# Altium project -STM32-Ethernet-IO-Gateway.PrjPcb
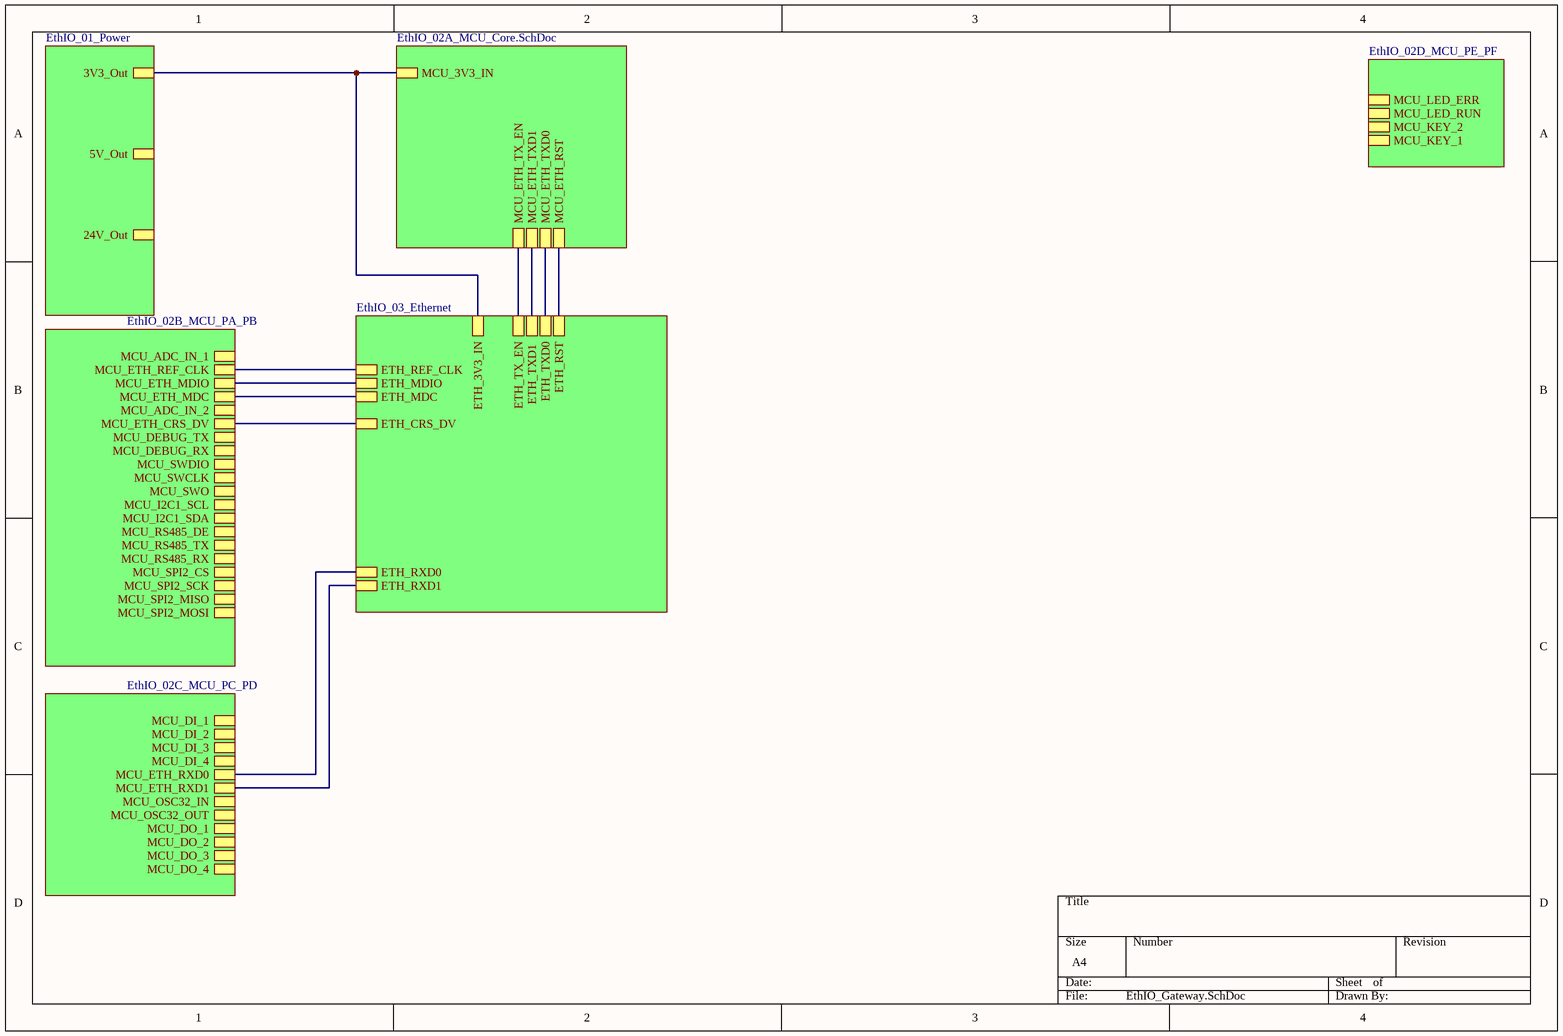
[diagram p0: EthIO_Gateway.SchDoc]
7 sheets, 89 parts. Net scope: hierarchical (ports join the sheet entries above them; power ports are global).
Board file: EthIO_Gateway.PcbDoc
Sheets:
  EthIO_Gateway.SchDoc
    EthIO_01_Power = EthIO_01_Power.SchDoc
    EthIO_02A_MCU_Core.SchDoc = EthIO_02A_MCU_Core.SchDoc
    EthIO_02B_MCU_PA_PB = EthIO_02B_MCU_PA_PB.SchDoc
    EthIO_02C_MCU_PC_PD = EthIO_02C_MCU_PC_PD.SchDoc
    EthIO_02D_MCU_PE_PF = EthIO_02D_MCU_PE_PF.SchDoc
    EthIO_03_Ethernet = EthIO_03_Ethernet.SchDoc

## Sheet EthIO_Gateway.SchDoc
size A4; SheetNumber: 1; SheetTotal: 7

### Sub-sheets
EthIO_01_Power = EthIO_01_Power: 3V3_Out, 5V_Out, 24V_Out
EthIO_02A_MCU_Core.SchDoc = EthIO_02A_MCU_Core.SchDoc: MCU_3V3_IN, MCU_ETH_TX_EN, MCU_ETH_TXD0, MCU_ETH_TXD1, MCU_ETH_RST
EthIO_02B_MCU_PA_PB = EthIO_02B_MCU_PA_PB: MCU_ADC_IN_1, MCU_ETH_REF_CLK, MCU_ETH_MDIO, MCU_ETH_MDC, MCU_ADC_IN_2, MCU_ETH_CRS_DV, MCU_DEBUG_TX, MCU_DEBUG_RX, MCU_SWDIO, MCU_SWCLK, MCU_SWO, MCU_I2C1_SCL, MCU_I2C1_SDA, MCU_RS485_DE, MCU_RS485_TX, MCU_RS485_RX, MCU_SPI2_CS, MCU_SPI2_SCK, MCU_SPI2_MISO, MCU_SPI2_MOSI
EthIO_02C_MCU_PC_PD = EthIO_02C_MCU_PC_PD: MCU_DI_1, MCU_DI_2, MCU_DI_3, MCU_DI_4, MCU_ETH_RXD0, MCU_ETH_RXD1, MCU_OSC32_IN, MCU_OSC32_OUT, MCU_DO_1, MCU_DO_2, MCU_DO_3, MCU_DO_4
EthIO_02D_MCU_PE_PF = EthIO_02D_MCU_PE_PF: MCU_KEY_1, MCU_KEY_2, MCU_LED_RUN, MCU_LED_ERR
EthIO_03_Ethernet = EthIO_03_Ethernet: ETH_TXD0, ETH_TXD1 , ETH_TX_EN, ETH_REF_CLK, ETH_MDC, ETH_CRS_DV, ETH_RXD1, ETH_MDIO, ETH_RXD0, ETH_RST, ETH_3V3_IN

### Nets
3V3_Out: sheet EthIO_01_Power/3V3_Out, sheet EthIO_02A_MCU_Core.SchDoc/MCU_3V3_IN, sheet EthIO_03_Ethernet/ETH_3V3_IN
ETH_CRS_DV: sheet EthIO_02B_MCU_PA_PB/MCU_ETH_CRS_DV, sheet EthIO_03_Ethernet/ETH_CRS_DV
ETH_MDC: sheet EthIO_02B_MCU_PA_PB/MCU_ETH_MDC, sheet EthIO_03_Ethernet/ETH_MDC
ETH_MDIO: sheet EthIO_02B_MCU_PA_PB/MCU_ETH_MDIO, sheet EthIO_03_Ethernet/ETH_MDIO
ETH_REF_CLK: sheet EthIO_02B_MCU_PA_PB/MCU_ETH_REF_CLK, sheet EthIO_03_Ethernet/ETH_REF_CLK
ETH_RST: sheet EthIO_02A_MCU_Core.SchDoc/MCU_ETH_RST, sheet EthIO_03_Ethernet/ETH_RST
ETH_RXD0: sheet EthIO_02C_MCU_PC_PD/MCU_ETH_RXD0, sheet EthIO_03_Ethernet/ETH_RXD0
ETH_RXD1: sheet EthIO_02C_MCU_PC_PD/MCU_ETH_RXD1, sheet EthIO_03_Ethernet/ETH_RXD1
ETH_TX_EN: sheet EthIO_02A_MCU_Core.SchDoc/MCU_ETH_TX_EN, sheet EthIO_03_Ethernet/ETH_TX_EN
ETH_TXD0: sheet EthIO_02A_MCU_Core.SchDoc/MCU_ETH_TXD0, sheet EthIO_03_Ethernet/ETH_TXD0
ETH_TXD1: sheet EthIO_02A_MCU_Core.SchDoc/MCU_ETH_TXD1, sheet EthIO_03_Ethernet/ETH_TXD1 

## Sheet EthIO_01_Power.SchDoc
size A4; SheetNumber: 2; SheetTotal: 5
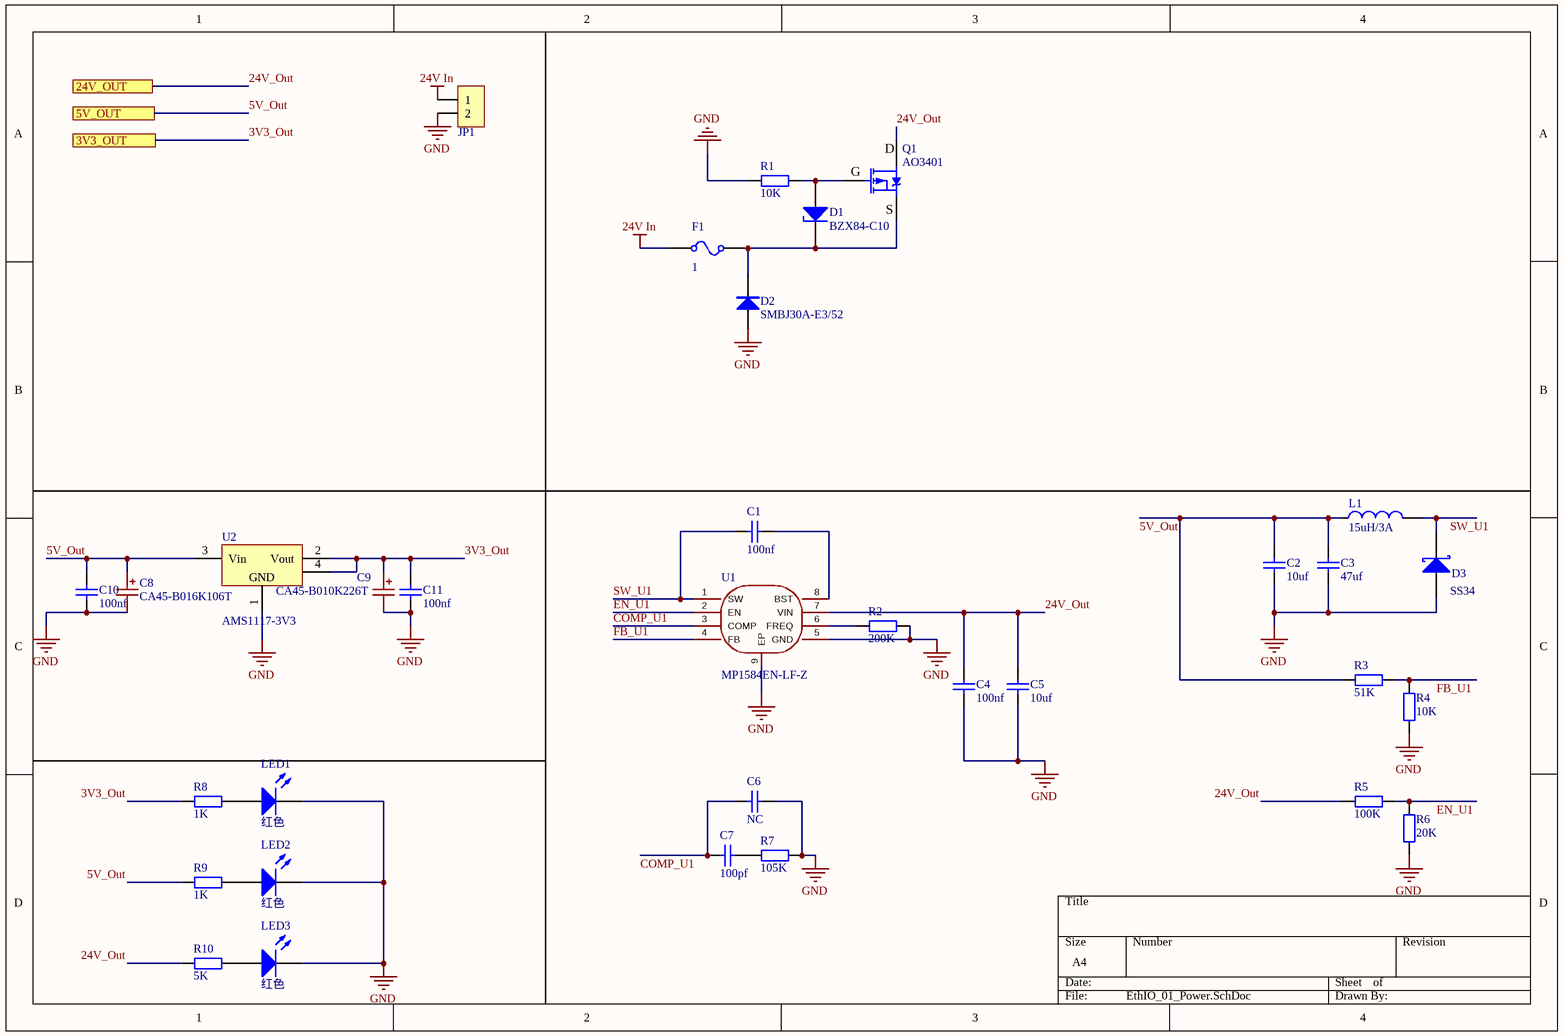
[diagram p1: EthIO_01_Power.SchDoc]

### Parts
C1  100nf  [C0805_L]
C2  10uf  [C0805_L]
C3  47uf  [C0805_L]
C4  100nf  [C0805_L]
C5  10uf  [C0805_L]
C6  NC  [C0805_L]
C7  100pf  [C0805_L]
C8  CA45-B016K106T  [CA45-B016K106T]
C9  CA45-B010K226T  [CA45-B016K106T]
C10  100nf  [C0805_L]
C11  100nf  [C0805_L]
D1  BZX84-C10  [SOD-123]
D2  SMBJ30A-E3/52  [SMB]
D3  SS34  [SMA]
F1  CURRENT: 1  (hidden comment: Fuse)
JP1  HDR-1X2  [KF128-3.81-2P]  (value not drawn)
L1  15uH/3A  [L0805]
LED1  红色  [LED0805_G]
LED2  红色  [LED0805_G]
LED3  红色  [LED0805_G]
Q1  AO3401  [SOT23-3N]
R1  10K  [R0805_L]
R2  200K  [R0805_L]
R3  51K  [R0805_L]
R4  10K  [R0805_L]
R5  100K  [R0805_L]
R6  20K  [R0805_L]
R7  105K  [R0805_L]
R8  1K  [R0805_L]
R9  1K  [R0805_L]
R10  5K  [R0805_L]
U1  MP1584EN-LF-Z  [MP1584EN-LF-Z]
U2  AMS1117-3V3  [SOT223_L]

### Ports
3V3_OUT (see EthIO_Gateway[1A]), 5V_OUT (see EthIO_Gateway[1A]), 24V_OUT (see EthIO_Gateway[1A])

### Nets
24V In: F1.2 JP1.1
GND: C2.1 C3.1 C4.1 C5.1 C6.1 C8.2 C9.2 C10.1 C11.1 D2.1(A) D3.1(A) JP1.2 LED1.2(K) LED2.2(K) LED3.2(K) R1.1 R2.2 R4.1 R6.2 R7.1 U1.5(GND) U1.9(EP) U2.1(GND)
3V3_Out: C9.1 C11.2 R8.1 U2.2(Vout) U2.4(GND) ; port 3V3_OUT
5V_Out: C2.2 C3.2 C8.1 C10.2 L1.1 R3.1 R9.1 U2.3(Vin) ; port 5V_OUT
24V_Out: C4.2 C5.2 Q1.3(D) R5.1 R10.1 U1.7(VIN) ; port 24V_OUT
COMP_U1: C6.2 C7.2 U1.3(COMP)
EN_U1: R5.2 R6.1 U1.2(EN)
FB_U1: R3.2 R4.2 U1.4(FB)
SW_U1: C1.2 D3.2(K) L1.2 U1.1(SW)
NetC1_1: C1.1 U1.8(BST)
NetC7_1: C7.1 R7.2
NetD1_1: D1.1(A) Q1.1(G) R1.2
NetD1_2: D1.2(K) D2.2(K) F1.1 Q1.2(S)
NetLED1_1: LED1.1(A) R8.2
NetLED2_1: LED2.1(A) R9.2
NetLED3_1: LED3.1(A) R10.2
NetR2_1: R2.1 U1.6(FREQ)

### Library data of the parts
C1-C7 C10 C11 = C: 贴片电容/MLCC电容; BOM名称: 无极性贴片电容; 当前库版本V2022.12.25 @淘宝卖家:黄晶宝石: 最新版本发布https://shop463601444.taobao.com
C9 = CA45-B016K106T
D1 = 稳压二极管: Zener Diode; 当前库版本V2022.12.25 @淘宝卖家:黄晶宝石: 最新版本发布https://shop463601444.taobao.com
D2 = SMBJ30A-E3/52: 30V 600W瞬态抑制二极管; BOM名称: TVS瞬态抑制二极管; 当前库版本V2022.12.25 @淘宝卖家:黄晶宝石: 最新版本发布https://shop463601444.taobao.com; 属性: 30V 600W
D3 = D-Schottky: 肖特基二极管; 当前库版本V2022.12.25 @淘宝卖家:黄晶宝石: 最新版本发布https://shop463601444.taobao.com
F1 = Fuse: RESISTANCE: 1m; SimulationGenericComponent: True
JP1 = Header 2: 2P接插件; 当前库版本V2022.10.7 @淘宝卖家:黄晶宝石: 最新版本发布https://shop463601444.taobao.com; BOM名称: 2P接插件
L1 = L: 贴片小功率电感; BOM名称: 小功率贴片电感; 联系下单店铺卖家 免费帮你查找封装: 联系下单店铺卖家 免费技术支持
LED1-LED3 = LED: 贴片LED; 封装库来自淘宝卖家：黄晶宝石: 其他店铺购入均为盗版封装库，无更新权益，请立即申请退款，本店现金奖励200~1000元; BOM名称: 贴片LED
Q1 = AO3401: P沟道 30V/4.2A; BOM名称: 场效应管; 联系下单店铺卖家 免费帮你查找封装: 联系下单店铺卖家 免费技术支持; 参数: P沟道 30V/4.2A
R1-R10 = R: 贴片电阻; 联系下单店铺卖家 免费帮你查找封装: 联系下单店铺卖家 免费技术支持; BOM名称: 贴片电阻
U2 = AMS1117: 三端稳压芯片; BOM名称: 稳压芯片; 当前库版本V2022.12.25 @淘宝卖家:黄晶宝石: 最新版本发布https://shop463601444.taobao.com

## Sheet EthIO_02A_MCU_Core.SchDoc
size A4; SheetNumber: 3; SheetTotal: 7
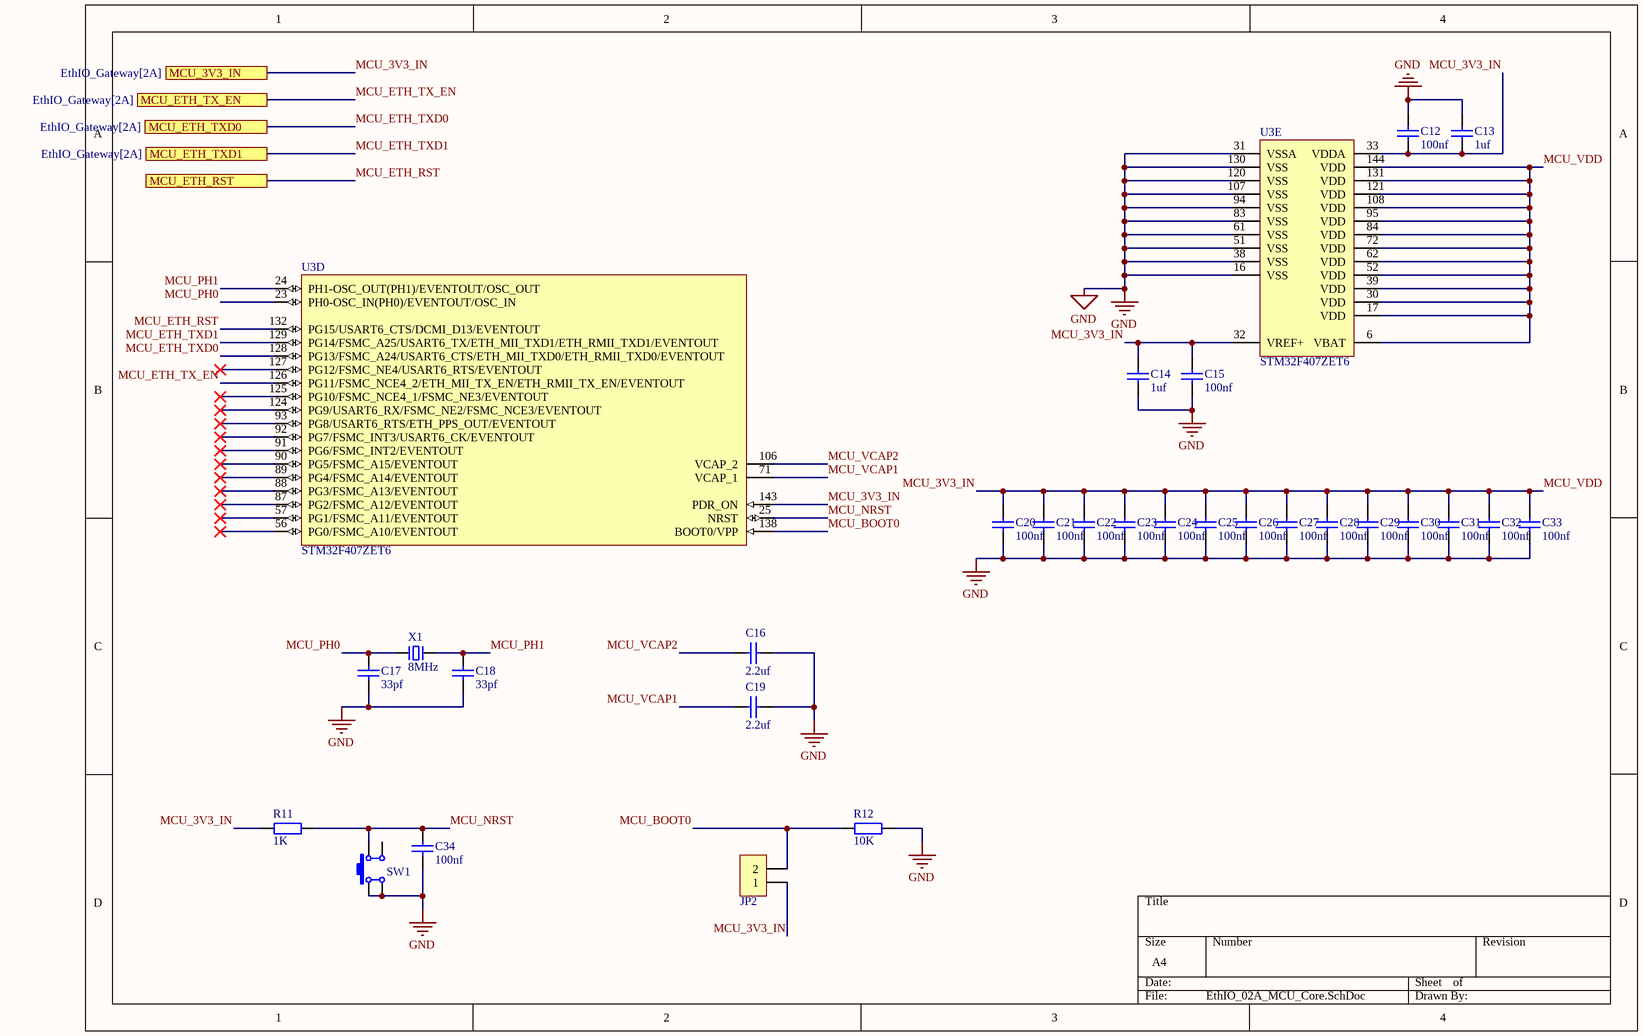
[diagram p2: EthIO_02A_MCU_Core.SchDoc]

### Parts
C12  100nf  [C0805_L]
C13  1uf  [C0805_L]
C14  1uf  [C0805_L]
C15  100nf  [C0805_L]
C16  2.2uf  [C0805_L]
C17  33pf  [C0805_L]
C18  33pf  [C0805_L]
C19  2.2uf  [C0805_L]
C20  100nf  [C0805_L]
C21  100nf  [C0805_L]
C22  100nf  [C0805_L]
C23  100nf  [C0805_L]
C24  100nf  [C0805_L]
C25  100nf  [C0805_L]
C26  100nf  [C0805_L]
C27  100nf  [C0805_L]
C28  100nf  [C0805_L]
C29  100nf  [C0805_L]
C30  100nf  [C0805_L]
C31  100nf  [C0805_L]
C32  100nf  [C0805_L]
C33  100nf  [C0805_L]
C34  100nf  [C0805_L]
JP2  HDR-1X2  [XH2.54-LI-2P]  (value not drawn)
R11  1K  [R0805_L]
R12  10K  [R0805_L]
SW1  12x12x5  [SW DIP-12*12*4.3]  (value not drawn)
U3  STM32F407ZET6  [TQFP144_V]  (parts D,E of 5)
X1  8MHz  [HC-49S]

### Ports
MCU_3V3_IN (see EthIO_Gateway[2A]), MCU_ETH_RST, MCU_ETH_TX_EN (see EthIO_Gateway[2A]), MCU_ETH_TXD0 (see EthIO_Gateway[2A]), MCU_ETH_TXD1 (see EthIO_Gateway[2A])

### Nets
GND: C12.2 C13.2 C14.2 C15.2 C16.2 C17.2 C18.2 C19.2 C20.2 C21.2 C22.2 C23.2 C24.2 C25.2 C26.2 C27.2 C28.2 C29.2 C30.2 C31.2 C32.2 C33.2 C34.2 R12.2 SW1.1 SW1.4 U3.16(VSS) U3.31(VSSA) U3.38(VSS) U3.51(VSS) U3.61(VSS) U3.83(VSS) U3.94(VSS) U3.107(VSS) U3.120(VSS) U3.130(VSS)
MCU_3V3_IN: C12.1 C13.1 C14.1 C15.1 C20.1 C21.1 C22.1 C23.1 C24.1 C25.1 C26.1 C27.1 C28.1 C29.1 C30.1 C31.1 C32.1 C33.1 JP2.1 R11.1 U3.6(VBAT) U3.17(VDD) U3.30(VDD) U3.32(VREF+) U3.33(VDDA) U3.39(VDD) U3.52(VDD) U3.62(VDD) U3.72(VDD) U3.84(VDD) U3.95(VDD) U3.108(VDD) U3.121(VDD) U3.131(VDD) U3.143(PDR_ON) U3.144(VDD) ; port MCU_3V3_IN  [also labelled MCU_VDD]  [project net 3V3_Out]
MCU_BOOT0: JP2.2 R12.1 U3.138(BOOT0/VPP)
MCU_ETH_RST: U3.132(PG15/USART6_CTS/DCMI_D13/EVENTOUT) ; port MCU_ETH_RST  [project net ETH_RST]
MCU_ETH_TX_EN: U3.126(PG11/FSMC_NCE4_2/ETH_MII_TX_EN/ETH_RMII_TX_EN/EVENTOUT) ; port MCU_ETH_TX_EN  [project net ETH_TX_EN]
MCU_ETH_TXD0: U3.128(PG13/FSMC_A24/USART6_CTS/ETH_MII_TXD0/ETH_RMII_TXD0/EVENTOUT) ; port MCU_ETH_TXD0  [project net ETH_TXD0]
MCU_ETH_TXD1: U3.129(PG14/FSMC_A25/USART6_TX/ETH_MII_TXD1/ETH_RMII_TXD1/EVENTOUT) ; port MCU_ETH_TXD1  [project net ETH_TXD1]
MCU_NRST: C34.1 R11.2 SW1.2 U3.25(NRST)
MCU_PH0: C17.1 U3.23(PH0-OSC_IN(PH0)/EVENTOUT/OSC_IN) X1.1
MCU_PH1: C18.1 U3.24(PH1-OSC_OUT(PH1)/EVENTOUT/OSC_OUT) X1.2
MCU_VCAP1: C19.1 U3.71(VCAP_1)
MCU_VCAP2: C16.1 U3.106(VCAP_2)

Not connected (* = marked no-connect by the designer): SW1 3; U3 56(PG0/FSMC_A10/EVENTOUT)* 57(PG1/FSMC_A11/EVENTOUT)* 87(PG2/FSMC_A12/EVENTOUT)* 88(PG3/FSMC_A13/EVENTOUT)* 89(PG4/FSMC_A14/EVENTOUT)* 90(PG5/FSMC_A15/EVENTOUT)* 91(PG6/FSMC_INT2/EVENTOUT)* 92(PG7/FSMC_INT3/USART6_CK/EVENTOUT)* 93(PG8/USART6_RTS/ETH_PPS_OUT/EVENTOUT)* 124(PG9/USART6_RX/FSMC_NE2/FSMC_NCE3/EVENTOUT)* 125(PG10/FSMC_NCE4_1/FSMC_NE3/EVENTOUT)* 127(PG12/FSMC_NE4/USART6_RTS/EVENTOUT)*

### Library data of the parts
C12-C34 = C: as C1 on sheet EthIO_01_Power
JP2 = Header 2: 跳帽; BOM名称: 2P接插件; 联系卖家，免费查找封装: 唯一出售店铺网址https://shop463601444.taobao.com; 封装库来自淘宝卖家ID：黄晶宝石: 其他店铺购入均为盗版封装库，请立即申请退款，本店现金奖励50~200元
R11 R12 = R: 贴片电阻; 联系下单店铺卖家 免费帮你查找封装: 联系下单店铺卖家 免费技术支持; BOM名称: 贴片电阻
SW1 = SW DIP-12x12: 直插12x12轻触开关; 联系下单店铺卖家 免费技术支持: 联系下单店铺卖家 免费帮你查找封装; BOM名称: 直插12x12轻触开关
U3 = STM32F407ZET6: ARM Cortex-M4 32b MCU+FPU, 210DMIP, 512 kB Flash, 192+4 kB RAM, Camera, 114 I/Os, 144-pin LQFP, -40 to +85癈, Tray; Internal RAM: 192kB; Operating Frequency (Processor Speed): 168MHz; A/D Converter: 24x12-bit; D/A Converter: 2x12-bit; 16-bit Timers (IC/OC/PWM): 12x16-bit(24/24/30); 32-bit Timer (IC/OC/PWM): 2x32-bit (8/8/8); Other Timer Functions: 2xWDG, RTC, 24-bit down counter; Serial Interface: 3xSPI/2xI2S/2xI2C/3xUSART(IrDa, ISO7816)/3xUART/2xUSB OTG FS/HS, 2xCAN/Ethernet MAC10/100, SDIO; 联系卖家，免费查找封装: 唯一出售店铺网址https://shop463601444.taobao.com; DatasheetVersion: rev2, Jan-2012; PackageVersion: 2012; PackageReference: TQFP144; PackageDescription: 144-Pin Low Profile Quad Flat Package, 20x20 mm Body, 0.5 mm Pitch; ComponentLink1Description: Manufacturer URL; ComponentLink1URL: http://www.st.com/; ComponentLink2Description: STM32F405/7 Datasheet; ComponentLink2URL: http://www.st.com/internet/com/TECHNICAL_RESOURCES/TECHNICAL_LITERATURE/DATASHEET/DM00037051.pdf; ComponentLink3Description: STM32F4 Web Page; ComponentLink3URL: http://www.st.com/internet/mcu/subclass/1521.jsp
X1 = XTAL-2P: 2脚无源晶振(谐振器）; 联系下单店铺卖家 免费帮你查找封装: 联系下单店铺卖家 免费技术支持; BOM名称: 2脚无源晶振(谐振器）

## Sheet EthIO_02B_MCU_PA_PB.SchDoc
size A4; SheetNumber: 4; SheetTotal: 7
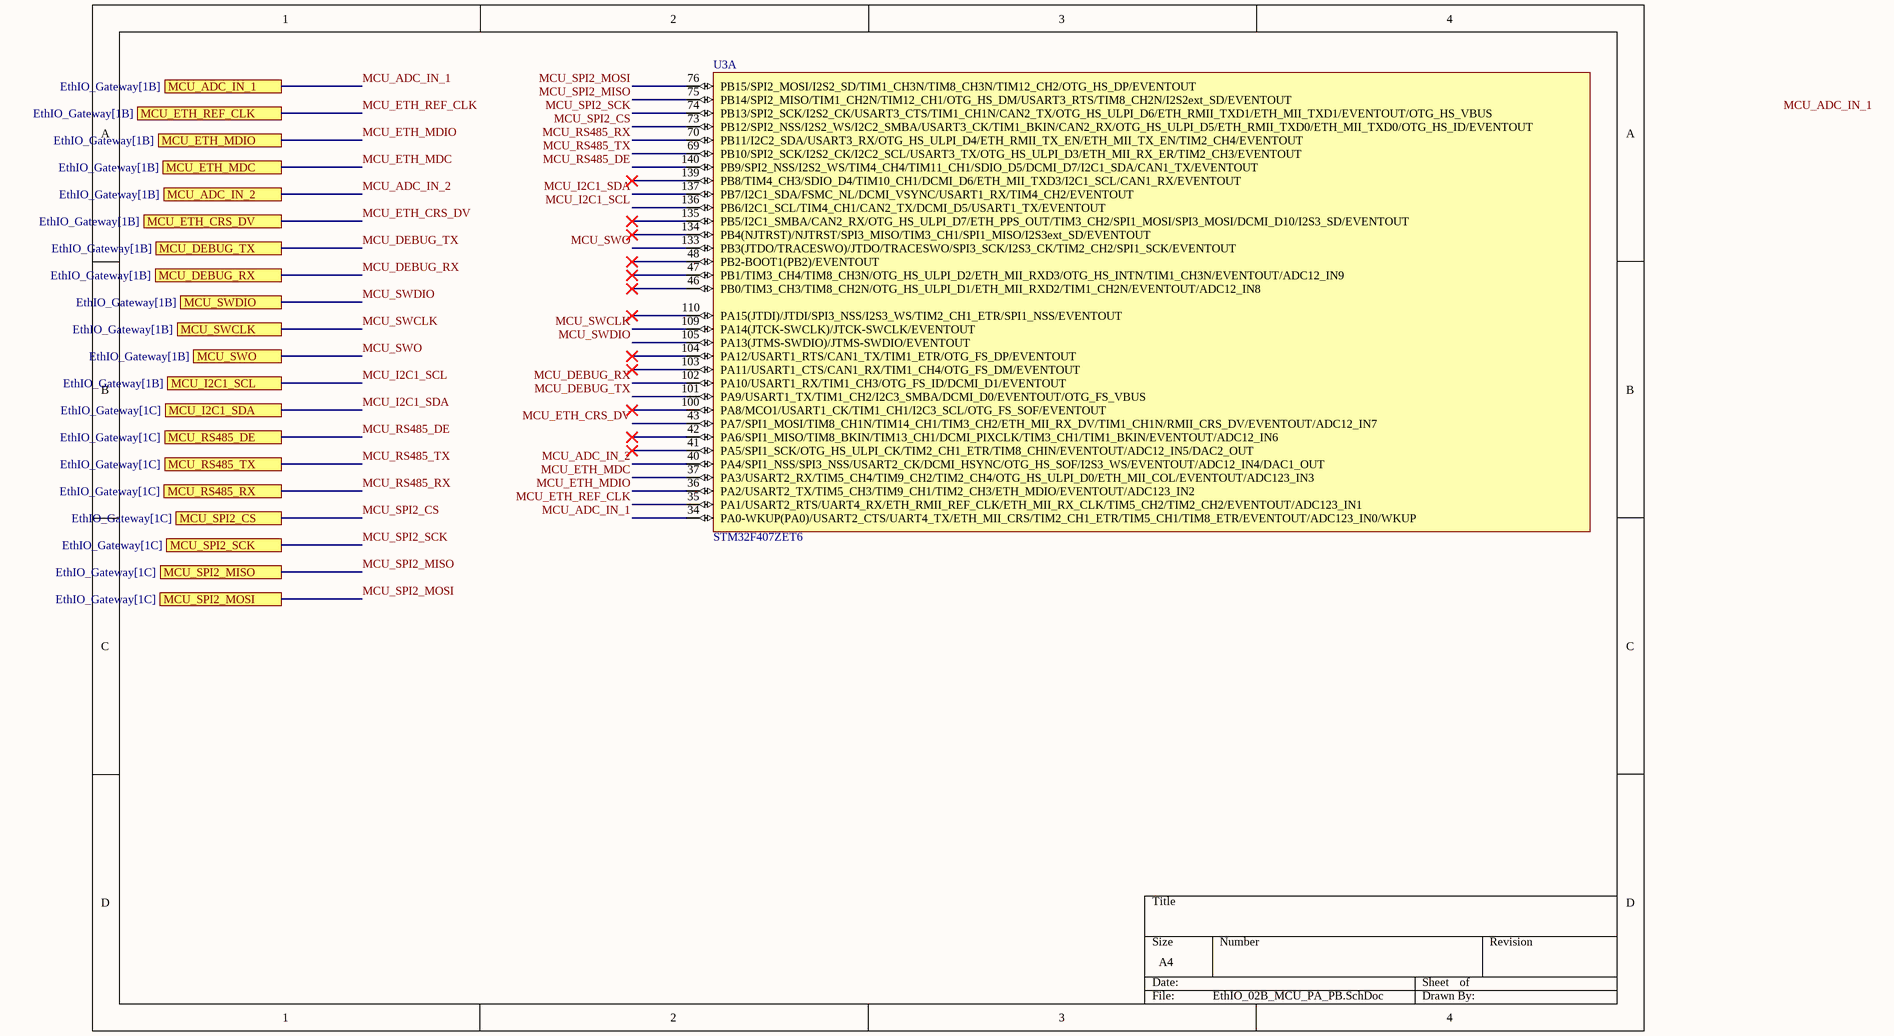
[diagram p3: EthIO_02B_MCU_PA_PB.SchDoc]

### Parts
U3  STM32F407ZET6  [TQFP144_V]  (part A of 5)

### Ports
MCU_ADC_IN_1 (see EthIO_Gateway[1B]), MCU_ADC_IN_2 (see EthIO_Gateway[1B]), MCU_DEBUG_RX (see EthIO_Gateway[1B]), MCU_DEBUG_TX (see EthIO_Gateway[1B]), MCU_ETH_CRS_DV (see EthIO_Gateway[1B]), MCU_ETH_MDC (see EthIO_Gateway[1B]), MCU_ETH_MDIO (see EthIO_Gateway[1B]), MCU_ETH_REF_CLK (see EthIO_Gateway[1B]), MCU_I2C1_SCL (see EthIO_Gateway[1B]), MCU_I2C1_SDA (see EthIO_Gateway[1C]), MCU_RS485_DE (see EthIO_Gateway[1C]), MCU_RS485_RX (see EthIO_Gateway[1C]), MCU_RS485_TX (see EthIO_Gateway[1C]), MCU_SPI2_CS (see EthIO_Gateway[1C]), MCU_SPI2_MISO (see EthIO_Gateway[1C]), MCU_SPI2_MOSI (see EthIO_Gateway[1C]), MCU_SPI2_SCK (see EthIO_Gateway[1C]), MCU_SWCLK (see EthIO_Gateway[1B]), MCU_SWDIO (see EthIO_Gateway[1B]), MCU_SWO (see EthIO_Gateway[1B])

### Nets
MCU_ADC_IN_1: U3.34(PA0-WKUP(PA0)/USART2_CTS/UART4_TX/ETH_MII_CRS/TIM2_CH1_ETR/TIM5_CH1/TIM8_ETR/EVENTOUT/ADC123_IN0/WKUP) ; port MCU_ADC_IN_1
MCU_ADC_IN_2: U3.40(PA4/SPI1_NSS/SPI3_NSS/USART2_CK/DCMI_HSYNC/OTG_HS_SOF/I2S3_WS/EVENTOUT/ADC12_IN4/DAC1_OUT) ; port MCU_ADC_IN_2
MCU_DEBUG_RX: U3.102(PA10/USART1_RX/TIM1_CH3/OTG_FS_ID/DCMI_D1/EVENTOUT) ; port MCU_DEBUG_RX
MCU_DEBUG_TX: U3.101(PA9/USART1_TX/TIM1_CH2/I2C3_SMBA/DCMI_D0/EVENTOUT/OTG_FS_VBUS) ; port MCU_DEBUG_TX
MCU_ETH_CRS_DV: U3.43(PA7/SPI1_MOSI/TIM8_CH1N/TIM14_CH1/TIM3_CH2/ETH_MII_RX_DV/TIM1_CH1N/RMII_CRS_DV/EVENTOUT/ADC12_IN7) ; port MCU_ETH_CRS_DV  [project net ETH_CRS_DV]
MCU_ETH_MDC: U3.37(PA3/USART2_RX/TIM5_CH4/TIM9_CH2/TIM2_CH4/OTG_HS_ULPI_D0/ETH_MII_COL/EVENTOUT/ADC123_IN3) ; port MCU_ETH_MDC  [project net ETH_MDC]
MCU_ETH_MDIO: U3.36(PA2/USART2_TX/TIM5_CH3/TIM9_CH1/TIM2_CH3/ETH_MDIO/EVENTOUT/ADC123_IN2) ; port MCU_ETH_MDIO  [project net ETH_MDIO]
MCU_ETH_REF_CLK: U3.35(PA1/USART2_RTS/UART4_RX/ETH_RMII_REF_CLK/ETH_MII_RX_CLK/TIM5_CH2/TIM2_CH2/EVENTOUT/ADC123_IN1) ; port MCU_ETH_REF_CLK  [project net ETH_REF_CLK]
MCU_I2C1_SCL: U3.136(PB6/I2C1_SCL/TIM4_CH1/CAN2_TX/DCMI_D5/USART1_TX/EVENTOUT) ; port MCU_I2C1_SCL
MCU_I2C1_SDA: U3.137(PB7/I2C1_SDA/FSMC_NL/DCMI_VSYNC/USART1_RX/TIM4_CH2/EVENTOUT) ; port MCU_I2C1_SDA
MCU_RS485_DE: U3.140(PB9/SPI2_NSS/I2S2_WS/TIM4_CH4/TIM11_CH1/SDIO_D5/DCMI_D7/I2C1_SDA/CAN1_TX/EVENTOUT) ; port MCU_RS485_DE
MCU_RS485_RX: U3.70(PB11/I2C2_SDA/USART3_RX/OTG_HS_ULPI_D4/ETH_RMII_TX_EN/ETH_MII_TX_EN/TIM2_CH4/EVENTOUT) ; port MCU_RS485_RX
MCU_RS485_TX: U3.69(PB10/SPI2_SCK/I2S2_CK/I2C2_SCL/USART3_TX/OTG_HS_ULPI_D3/ETH_MII_RX_ER/TIM2_CH3/EVENTOUT) ; port MCU_RS485_TX
MCU_SPI2_CS: U3.73(PB12/SPI2_NSS/I2S2_WS/I2C2_SMBA/USART3_CK/TIM1_BKIN/CAN2_RX/OTG_HS_ULPI_D5/ETH_RMII_TXD0/ETH_MII_TXD0/OTG_HS_ID/EVENTOUT) ; port MCU_SPI2_CS
MCU_SPI2_MISO: U3.75(PB14/SPI2_MISO/TIM1_CH2N/TIM12_CH1/OTG_HS_DM/USART3_RTS/TIM8_CH2N/I2S2ext_SD/EVENTOUT) ; port MCU_SPI2_MISO
MCU_SPI2_MOSI: U3.76(PB15/SPI2_MOSI/I2S2_SD/TIM1_CH3N/TIM8_CH3N/TIM12_CH2/OTG_HS_DP/EVENTOUT) ; port MCU_SPI2_MOSI
MCU_SPI2_SCK: U3.74(PB13/SPI2_SCK/I2S2_CK/USART3_CTS/TIM1_CH1N/CAN2_TX/OTG_HS_ULPI_D6/ETH_RMII_TXD1/ETH_MII_TXD1/EVENTOUT/OTG_HS_VBUS) ; port MCU_SPI2_SCK
MCU_SWCLK: U3.109(PA14(JTCK-SWCLK)/JTCK-SWCLK/EVENTOUT) ; port MCU_SWCLK
MCU_SWDIO: U3.105(PA13(JTMS-SWDIO)/JTMS-SWDIO/EVENTOUT) ; port MCU_SWDIO
MCU_SWO: U3.133(PB3(JTDO/TRACESWO)/JTDO/TRACESWO/SPI3_SCK/I2S3_CK/TIM2_CH2/SPI1_SCK/EVENTOUT) ; port MCU_SWO

Not connected (* = marked no-connect by the designer): U3 41(PA5/SPI1_SCK/OTG_HS_ULPI_CK/TIM2_CH1_ETR/TIM8_CHIN/EVENTOUT/ADC12_IN5/DAC2_OUT)* 42(PA6/SPI1_MISO/TIM8_BKIN/TIM13_CH1/DCMI_PIXCLK/TIM3_CH1/TIM1_BKIN/EVENTOUT/ADC12_IN6)* 46(PB0/TIM3_CH3/TIM8_CH2N/OTG_HS_ULPI_D1/ETH_MII_RXD2/TIM1_CH2N/EVENTOUT/ADC12_IN8)* 47(PB1/TIM3_CH4/TIM8_CH3N/OTG_HS_ULPI_D2/ETH_MII_RXD3/OTG_HS_INTN/TIM1_CH3N/EVENTOUT/ADC12_IN9)* 48(PB2-BOOT1(PB2)/EVENTOUT)* 100(PA8/MCO1/USART1_CK/TIM1_CH1/I2C3_SCL/OTG_FS_SOF/EVENTOUT)* 103(PA11/USART1_CTS/CAN1_RX/TIM1_CH4/OTG_FS_DM/EVENTOUT)* 104(PA12/USART1_RTS/CAN1_TX/TIM1_ETR/OTG_FS_DP/EVENTOUT)* 110(PA15(JTDI)/JTDI/SPI3_NSS/I2S3_WS/TIM2_CH1_ETR/SPI1_NSS/EVENTOUT)* 134(PB4(NJTRST)/NJTRST/SPI3_MISO/TIM3_CH1/SPI1_MISO/I2S3ext_SD/EVENTOUT)* 135(PB5/I2C1_SMBA/CAN2_RX/OTG_HS_ULPI_D7/ETH_PPS_OUT/TIM3_CH2/SPI1_MOSI/SPI3_MOSI/DCMI_D10/I2S3_SD/EVENTOUT)* 139(PB8/TIM4_CH3/SDIO_D4/TIM10_CH1/DCMI_D6/ETH_MII_TXD3/I2C1_SCL/CAN1_RX/EVENTOUT)*

### Notes on the sheet
- Labels drawn without touching a wire or pin: MCU_ADC_IN_1

### Library data of the parts
U3 = STM32F407ZET6: as U3 on sheet EthIO_02A_MCU_Core; DatasheetVersion: rev2, Jan-2012; PackageVersion: 2012; PackageReference: TQFP144; PackageDescription: 144-Pin Low Profile Quad Flat Package, 20x20 mm Body, 0.5 mm Pitch; ComponentLink1Description: Manufacturer URL; ComponentLink1URL: http://www.st.com/; ComponentLink2Description: STM32F405/7 Datasheet; ComponentLink2URL: http://www.st.com/internet/com/TECHNICAL_RESOURCES/TECHNICAL_LITERATURE/DATASHEET/DM00037051.pdf; ComponentLink3Description: STM32F4 Web Page; ComponentLink3URL: http://www.st.com/internet/mcu/subclass/1521.jsp

## Sheet EthIO_02C_MCU_PC_PD.SchDoc
size A4; SheetNumber: 5; SheetTotal: 5
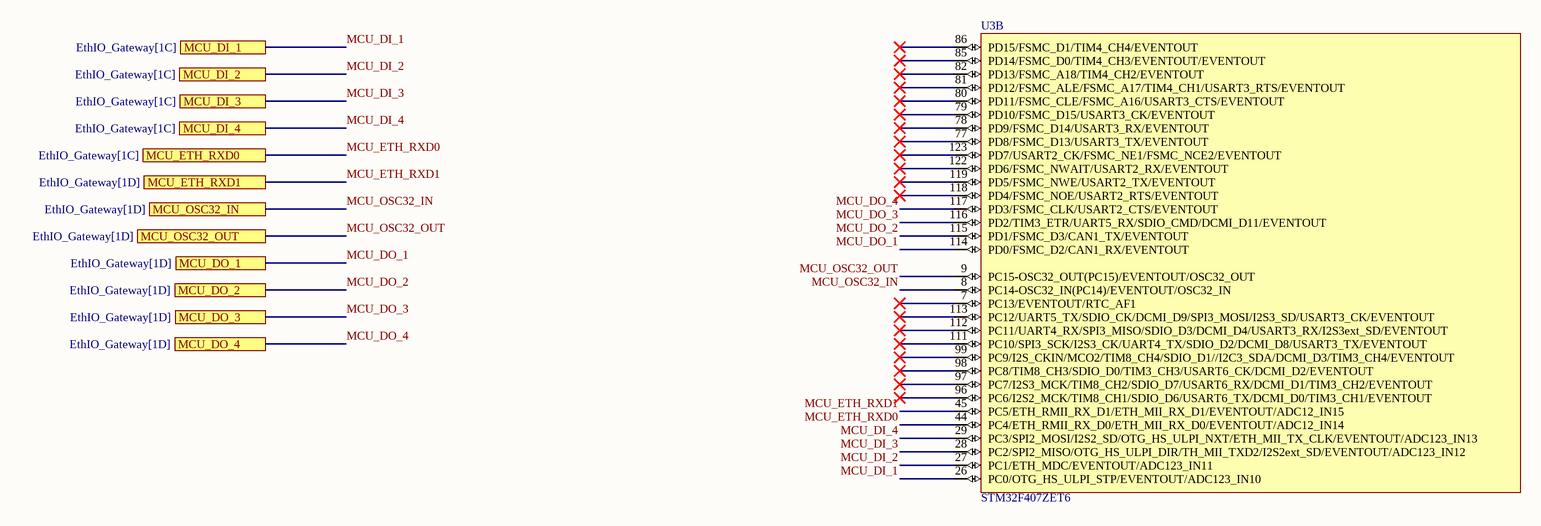
[diagram p4: EthIO_02C_MCU_PC_PD.SchDoc]

### Parts
U3  STM32F407ZET6  [TQFP144_V]  (part B of 5)

### Ports
MCU_DI_1 (see EthIO_Gateway[1C]), MCU_DI_2 (see EthIO_Gateway[1C]), MCU_DI_3 (see EthIO_Gateway[1C]), MCU_DI_4 (see EthIO_Gateway[1C]), MCU_DO_1 (see EthIO_Gateway[1D]), MCU_DO_2 (see EthIO_Gateway[1D]), MCU_DO_3 (see EthIO_Gateway[1D]), MCU_DO_4 (see EthIO_Gateway[1D]), MCU_ETH_RXD0 (see EthIO_Gateway[1C]), MCU_ETH_RXD1 (see EthIO_Gateway[1D]), MCU_OSC32_IN (see EthIO_Gateway[1D]), MCU_OSC32_OUT (see EthIO_Gateway[1D])

### Nets
MCU_DI_1: U3.26(PC0/OTG_HS_ULPI_STP/EVENTOUT/ADC123_IN10) ; port MCU_DI_1
MCU_DI_2: U3.27(PC1/ETH_MDC/EVENTOUT/ADC123_IN11) ; port MCU_DI_2
MCU_DI_3: U3.28(PC2/SPI2_MISO/OTG_HS_ULPI_DIR/TH_MII_TXD2/I2S2ext_SD/EVENTOUT/ADC123_IN12) ; port MCU_DI_3
MCU_DI_4: U3.29(PC3/SPI2_MOSI/I2S2_SD/OTG_HS_ULPI_NXT/ETH_MII_TX_CLK/EVENTOUT/ADC123_IN13) ; port MCU_DI_4
MCU_DO_1: U3.114(PD0/FSMC_D2/CAN1_RX/EVENTOUT) ; port MCU_DO_1
MCU_DO_2: U3.115(PD1/FSMC_D3/CAN1_TX/EVENTOUT) ; port MCU_DO_2
MCU_DO_3: U3.116(PD2/TIM3_ETR/UART5_RX/SDIO_CMD/DCMI_D11/EVENTOUT) ; port MCU_DO_3
MCU_DO_4: U3.117(PD3/FSMC_CLK/USART2_CTS/EVENTOUT) ; port MCU_DO_4
MCU_ETH_RXD0: U3.44(PC4/ETH_RMII_RX_D0/ETH_MII_RX_D0/EVENTOUT/ADC12_IN14) ; port MCU_ETH_RXD0  [project net ETH_RXD0]
MCU_ETH_RXD1: U3.45(PC5/ETH_RMII_RX_D1/ETH_MII_RX_D1/EVENTOUT/ADC12_IN15) ; port MCU_ETH_RXD1  [project net ETH_RXD1]
MCU_OSC32_IN: U3.8(PC14-OSC32_IN(PC14)/EVENTOUT/OSC32_IN) ; port MCU_OSC32_IN
MCU_OSC32_OUT: U3.9(PC15-OSC32_OUT(PC15)/EVENTOUT/OSC32_OUT) ; port MCU_OSC32_OUT

Not connected (* = marked no-connect by the designer): U3 7(PC13/EVENTOUT/RTC_AF1)* 77(PD8/FSMC_D13/USART3_TX/EVENTOUT)* 78(PD9/FSMC_D14/USART3_RX/EVENTOUT)* 79(PD10/FSMC_D15/USART3_CK/EVENTOUT)* 80(PD11/FSMC_CLE/FSMC_A16/USART3_CTS/EVENTOUT)* 81(PD12/FSMC_ALE/FSMC_A17/TIM4_CH1/USART3_RTS/EVENTOUT)* 82(PD13/FSMC_A18/TIM4_CH2/EVENTOUT)* 85(PD14/FSMC_D0/TIM4_CH3/EVENTOUT/EVENTOUT)* 86(PD15/FSMC_D1/TIM4_CH4/EVENTOUT)* 96(PC6/I2S2_MCK/TIM8_CH1/SDIO_D6/USART6_TX/DCMI_D0/TIM3_CH1/EVENTOUT)* 97(PC7/I2S3_MCK/TIM8_CH2/SDIO_D7/USART6_RX/DCMI_D1/TIM3_CH2/EVENTOUT)* 98(PC8/TIM8_CH3/SDIO_D0/TIM3_CH3/USART6_CK/DCMI_D2/EVENTOUT)* 99(PC9/I2S_CKIN/MCO2/TIM8_CH4/SDIO_D1//I2C3_SDA/DCMI_D3/TIM3_CH4/EVENTOUT)* 111(PC10/SPI3_SCK/I2S3_CK/UART4_TX/SDIO_D2/DCMI_D8/USART3_TX/EVENTOUT)* 112(PC11/UART4_RX/SPI3_MISO/SDIO_D3/DCMI_D4/USART3_RX/I2S3ext_SD/EVENTOUT)* 113(PC12/UART5_TX/SDIO_CK/DCMI_D9/SPI3_MOSI/I2S3_SD/USART3_CK/EVENTOUT)* 118(PD4/FSMC_NOE/USART2_RTS/EVENTOUT)* 119(PD5/FSMC_NWE/USART2_TX/EVENTOUT)* 122(PD6/FSMC_NWAIT/USART2_RX/EVENTOUT)* 123(PD7/USART2_CK/FSMC_NE1/FSMC_NCE2/EVENTOUT)*

### Library data of the parts
U3 = STM32F407ZET6: as U3 on sheet EthIO_02A_MCU_Core; DatasheetVersion: rev2, Jan-2012; PackageVersion: 2012; PackageReference: TQFP144; PackageDescription: 144-Pin Low Profile Quad Flat Package, 20x20 mm Body, 0.5 mm Pitch; ComponentLink1Description: Manufacturer URL; ComponentLink1URL: http://www.st.com/; ComponentLink2Description: STM32F405/7 Datasheet; ComponentLink2URL: http://www.st.com/internet/com/TECHNICAL_RESOURCES/TECHNICAL_LITERATURE/DATASHEET/DM00037051.pdf; ComponentLink3Description: STM32F4 Web Page; ComponentLink3URL: http://www.st.com/internet/mcu/subclass/1521.jsp

## Sheet EthIO_02D_MCU_PE_PF.SchDoc
size A4; SheetNumber: 5; SheetTotal: 5
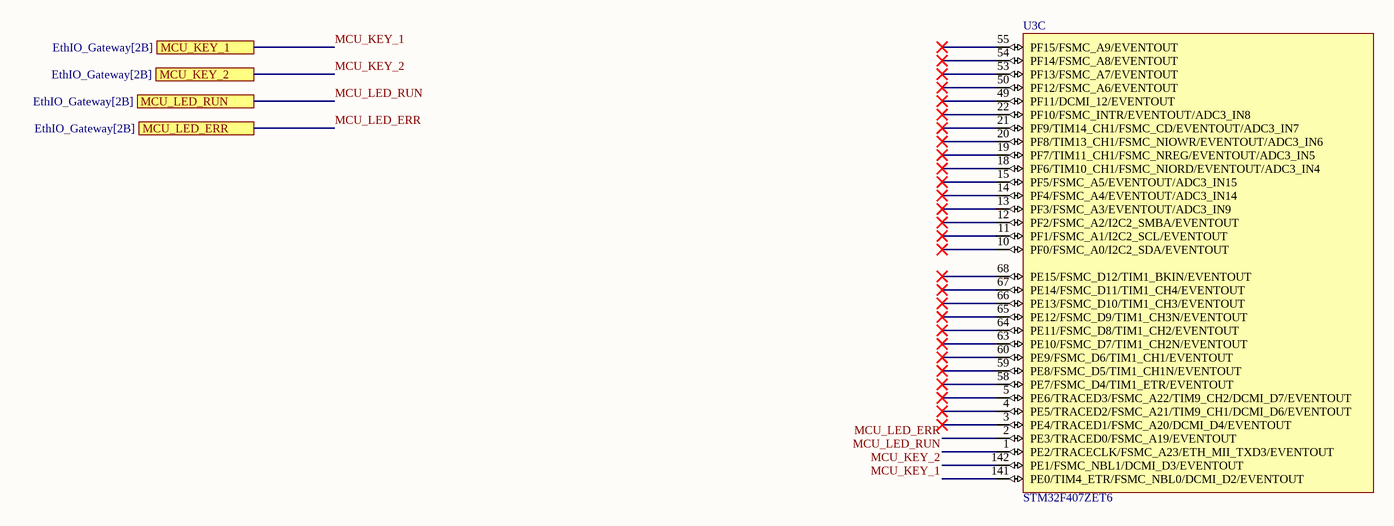
[diagram p5: EthIO_02D_MCU_PE_PF.SchDoc]

### Parts
U3  STM32F407ZET6  [TQFP144_V]  (part C of 5)

### Ports
MCU_KEY_1 (see EthIO_Gateway[2B]), MCU_KEY_2 (see EthIO_Gateway[2B]), MCU_LED_ERR (see EthIO_Gateway[2B]), MCU_LED_RUN (see EthIO_Gateway[2B])

### Nets
MCU_KEY_1: U3.141(PE0/TIM4_ETR/FSMC_NBL0/DCMI_D2/EVENTOUT) ; port MCU_KEY_1
MCU_KEY_2: U3.142(PE1/FSMC_NBL1/DCMI_D3/EVENTOUT) ; port MCU_KEY_2
MCU_LED_ERR: U3.2(PE3/TRACED0/FSMC_A19/EVENTOUT) ; port MCU_LED_ERR
MCU_LED_RUN: U3.1(PE2/TRACECLK/FSMC_A23/ETH_MII_TXD3/EVENTOUT) ; port MCU_LED_RUN

Not connected (* = marked no-connect by the designer): U3 3(PE4/TRACED1/FSMC_A20/DCMI_D4/EVENTOUT)* 4(PE5/TRACED2/FSMC_A21/TIM9_CH1/DCMI_D6/EVENTOUT)* 5(PE6/TRACED3/FSMC_A22/TIM9_CH2/DCMI_D7/EVENTOUT)* 10(PF0/FSMC_A0/I2C2_SDA/EVENTOUT)* 11(PF1/FSMC_A1/I2C2_SCL/EVENTOUT)* 12(PF2/FSMC_A2/I2C2_SMBA/EVENTOUT)* 13(PF3/FSMC_A3/EVENTOUT/ADC3_IN9)* 14(PF4/FSMC_A4/EVENTOUT/ADC3_IN14)* 15(PF5/FSMC_A5/EVENTOUT/ADC3_IN15)* 18(PF6/TIM10_CH1/FSMC_NIORD/EVENTOUT/ADC3_IN4)* 19(PF7/TIM11_CH1/FSMC_NREG/EVENTOUT/ADC3_IN5)* 20(PF8/TIM13_CH1/FSMC_NIOWR/EVENTOUT/ADC3_IN6)* 21(PF9/TIM14_CH1/FSMC_CD/EVENTOUT/ADC3_IN7)* 22(PF10/FSMC_INTR/EVENTOUT/ADC3_IN8)* 49(PF11/DCMI_12/EVENTOUT)* 50(PF12/FSMC_A6/EVENTOUT)* 53(PF13/FSMC_A7/EVENTOUT)* 54(PF14/FSMC_A8/EVENTOUT)* 55(PF15/FSMC_A9/EVENTOUT)* 58(PE7/FSMC_D4/TIM1_ETR/EVENTOUT)* 59(PE8/FSMC_D5/TIM1_CH1N/EVENTOUT)* 60(PE9/FSMC_D6/TIM1_CH1/EVENTOUT)* 63(PE10/FSMC_D7/TIM1_CH2N/EVENTOUT)* 64(PE11/FSMC_D8/TIM1_CH2/EVENTOUT)* 65(PE12/FSMC_D9/TIM1_CH3N/EVENTOUT)* 66(PE13/FSMC_D10/TIM1_CH3/EVENTOUT)* 67(PE14/FSMC_D11/TIM1_CH4/EVENTOUT)* 68(PE15/FSMC_D12/TIM1_BKIN/EVENTOUT)*

### Library data of the parts
U3 = STM32F407ZET6: as U3 on sheet EthIO_02A_MCU_Core; DatasheetVersion: rev2, Jan-2012; PackageVersion: 2012; PackageReference: TQFP144; PackageDescription: 144-Pin Low Profile Quad Flat Package, 20x20 mm Body, 0.5 mm Pitch; ComponentLink1Description: Manufacturer URL; ComponentLink1URL: http://www.st.com/; ComponentLink2Description: STM32F405/7 Datasheet; ComponentLink2URL: http://www.st.com/internet/com/TECHNICAL_RESOURCES/TECHNICAL_LITERATURE/DATASHEET/DM00037051.pdf; ComponentLink3Description: STM32F4 Web Page; ComponentLink3URL: http://www.st.com/internet/mcu/subclass/1521.jsp

## Sheet EthIO_03_Ethernet.SchDoc
size A4; SheetNumber: 7; SheetTotal: 8
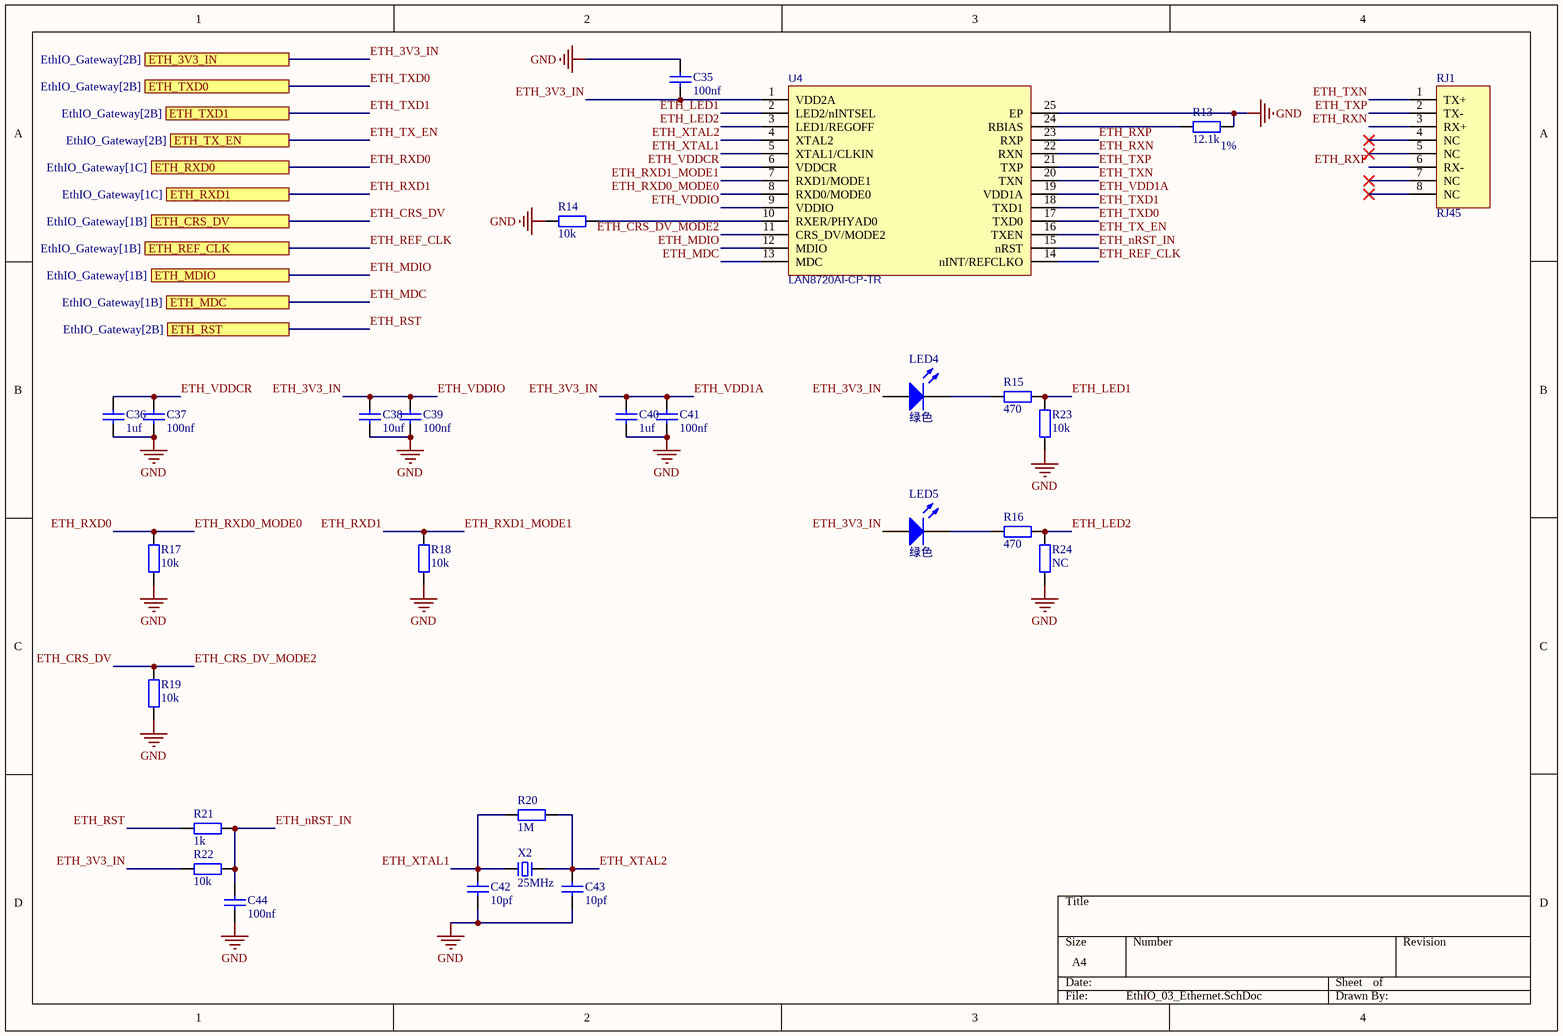
[diagram p6: EthIO_03_Ethernet.SchDoc]

### Parts
C35  100nf  [C0805_L]
C36  1uf  [C0805_L]
C37  100nf  [C0805_L]
C38  10uf  [C0805_L]
C39  100nf  [C0805_L]
C40  1uf  [C0805_L]
C41  100nf  [C0805_L]
C42  10pf  [C0805_L]
C43  10pf  [C0805_L]
C44  100nf  [C0805_L]
LED4  绿色  [LED0805_G]
LED5  绿色  [LED0805_G]
R13  12.1k  Tolerance: 1%  [R0805_L]
R14  10k  [R0805_L]
R15  470  [R0805_L]
R16  470  [R0805_L]
R17  10k  [R0805_L]
R18  10k  [R0805_L]
R19  10k  [R0805_L]
R20  1M  [R0805_L]
R21  1k  [R0805_L]
R22  10k  [R0805_L]
R23  10k  [R0805_L]
R24  NC  [R0805_L]
RJ1  RJ45  [RJ45-2]
U4  LAN8720AI-CP-TR  [QFN24 4x4_N]
X2  25MHz  [HC-49S]

### Ports
ETH_3V3_IN (see EthIO_Gateway[2B]), ETH_CRS_DV (see EthIO_Gateway[1B]), ETH_MDC (see EthIO_Gateway[1B]), ETH_MDIO (see EthIO_Gateway[1B]), ETH_REF_CLK (see EthIO_Gateway[1B]), ETH_RST (see EthIO_Gateway[2B]), ETH_RXD0 (see EthIO_Gateway[1C]), ETH_RXD1 (see EthIO_Gateway[1C]), ETH_TX_EN (see EthIO_Gateway[2B]), ETH_TXD0 (see EthIO_Gateway[2B]), ETH_TXD1 (see EthIO_Gateway[2B])

### Nets
GND: C35.1 C36.2 C37.2 C38.2 C39.2 C40.2 C41.2 C42.2 C43.2 C44.2 R13.1 R14.2 R17.1 R18.1 R19.1 R23.1 R24.1 U4.25(EP)
ETH_3V3_IN: C35.2 C38.1 C39.1 C40.1 C41.1 LED4.1(A) LED5.1(A) R22.1 U4.1(VDD2A) U4.9(VDDIO) U4.19(VDD1A) ; port ETH_3V3_IN  [also labelled ETH_VDD1A, ETH_VDDIO]  [project net 3V3_Out]
ETH_CRS_DV: R19.2 U4.11(CRS_DV/MODE2) ; port ETH_CRS_DV  [also labelled ETH_CRS_DV_MODE2]
ETH_LED1: R15.1 R23.2 U4.2(LED2/nINTSEL)
ETH_LED2: R16.1 R24.2 U4.3(LED1/REGOFF)
ETH_MDC: U4.13(MDC) ; port ETH_MDC
ETH_MDIO: U4.12(MDIO) ; port ETH_MDIO
ETH_nRST_IN: C44.1 R21.2 R22.2 U4.15(nRST)
ETH_REF_CLK: U4.14(nINT/REFCLKO) ; port ETH_REF_CLK
ETH_RST: R21.1 ; port ETH_RST
ETH_RXD0: R17.2 U4.8(RXD0/MODE0) ; port ETH_RXD0  [also labelled ETH_RXD0_MODE0]
ETH_RXD1: R18.2 U4.7(RXD1/MODE1) ; port ETH_RXD1  [also labelled ETH_RXD1_MODE1]
ETH_RXN: RJ1.3(RX+) U4.22(RXN)
ETH_RXP: RJ1.6(RX-) U4.23(RXP)
ETH_TX_EN: U4.16(TXEN) ; port ETH_TX_EN
ETH_TXD0: U4.17(TXD0) ; port ETH_TXD0
ETH_TXD1: U4.18(TXD1) ; port ETH_TXD1
ETH_TXN: RJ1.1(TX+) U4.20(TXN)
ETH_TXP: RJ1.2(TX-) U4.21(TXP)
ETH_VDDCR: C36.1 C37.1 U4.6(VDDCR)
ETH_XTAL1: C42.1 R20.1 U4.5(XTAL1/CLKIN) X2.1
ETH_XTAL2: C43.1 R20.2 U4.4(XTAL2) X2.2
NetLED4_2: LED4.2(K) R15.2
NetLED5_2: LED5.2(K) R16.2
NetR13_2: R13.2 U4.24(RBIAS)
NetR14_1: R14.1 U4.10(RXER/PHYAD0)

Not connected (* = marked no-connect by the designer): RJ1 4(NC)* 5(NC)* 7(NC)* 8(NC)*

### Library data of the parts
C35-C44 = C: as C1 on sheet EthIO_01_Power
LED4 LED5 = LED: as LED1 on sheet EthIO_01_Power; BOM名称: 贴片LED
R13 = R: 贴片电阻; BOM名称: 贴片电阻
R14-R24 = R: 贴片电阻; 联系下单店铺卖家 免费帮你查找封装: 联系下单店铺卖家 免费技术支持; BOM名称: 贴片电阻
RJ1 = RJ45: 以太网接口; 当前库版本V2022.12.25 @淘宝卖家:黄晶宝石: 最新版本发布https://shop463601444.taobao.com; BOM名称: 以太网接口
U4 = LAN8720AI-CP-TR: 100M 以太网PHY; 芯片厂商: SMSC; 封装库来自淘宝卖家：黄晶宝石: 其他店铺购入均为盗版封装库，无更新权益，退款现金奖励200~1000元; 当前库版本V2022.12.25 @淘宝卖家:黄晶宝石: 最新版本发布https://shop463601444.taobao.com
X2 = XTAL-2P: as X1 on sheet EthIO_02A_MCU_Core; BOM名称: 2脚无源晶振(谐振器）

## Nets that join several sheets
GND: EthIO_01_Power (23 pins), EthIO_02A_MCU_Core (36 pins), EthIO_03_Ethernet (18 pins)
3V3_Out: EthIO_01_Power (5 pins), EthIO_02A_MCU_Core (36 pins), EthIO_03_Ethernet (11 pins)
ETH_CRS_DV: EthIO_02B_MCU_PA_PB (U3.43), EthIO_03_Ethernet (R19.2 U4.11)
ETH_MDC: EthIO_02B_MCU_PA_PB (U3.37), EthIO_03_Ethernet (U4.13)
ETH_MDIO: EthIO_02B_MCU_PA_PB (U3.36), EthIO_03_Ethernet (U4.12)
ETH_REF_CLK: EthIO_02B_MCU_PA_PB (U3.35), EthIO_03_Ethernet (U4.14)
ETH_RST: EthIO_02A_MCU_Core (U3.132), EthIO_03_Ethernet (R21.1)
ETH_RXD0: EthIO_02C_MCU_PC_PD (U3.44), EthIO_03_Ethernet (R17.2 U4.8)
ETH_RXD1: EthIO_02C_MCU_PC_PD (U3.45), EthIO_03_Ethernet (R18.2 U4.7)
ETH_TX_EN: EthIO_02A_MCU_Core (U3.126), EthIO_03_Ethernet (U4.16)
ETH_TXD0: EthIO_02A_MCU_Core (U3.128), EthIO_03_Ethernet (U4.17)
ETH_TXD1: EthIO_02A_MCU_Core (U3.129), EthIO_03_Ethernet (U4.18)